# Altium schematic sheet power.SchDoc
size Letter
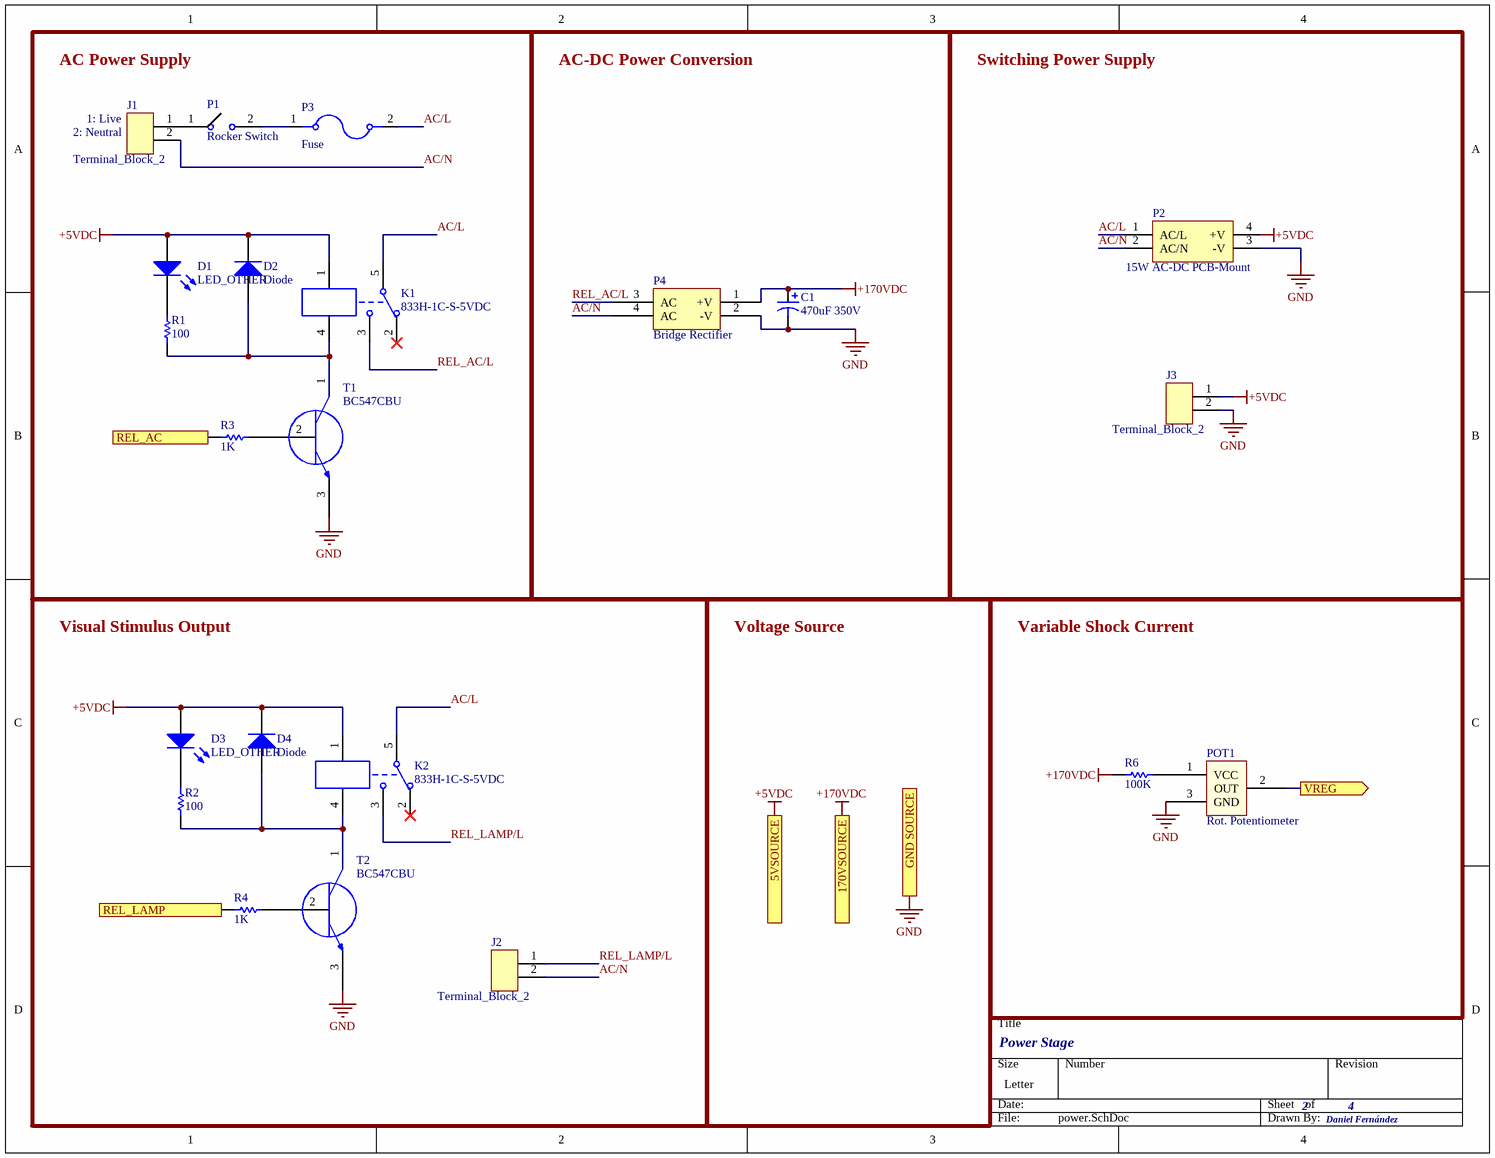
[diagram p0: power.SchDoc]

## Parts
C1  470uF 350V  [ESMQ351VSN471MR35S]
D1  LED_OTHER  [LED_AXIAL]
D2  Diode  [Diodo 1N4007 Rectificador]
D3  LED_OTHER  [LED_AXIAL]
D4  Diode  [Diodo 1N4007 Rectificador]
J1  Terminal_Block_2  [Terminal_Block_2]
J2  Terminal_Block_2  [Terminal_Block_2]
J3  Terminal_Block_2  [Terminal_Block_2]
K1  833H-1C-S-5VDC  [Relay_833H]
K2  833H-1C-S-5VDC  [Relay_833H]
P1  Rocker Switch  [Rocker Switch]
P2  15W AC-DC PCB-Mount  [15W AC-DC PCB-Mount]
P3  Fuse  [Fuse Holder]
P4  Bridge Rectifier  [KBPC1010]
POT1  Rot. Potentiometer  [PTV09A-4020F-B504]
R1  100  [RESISTOR]
R2  100  [RESISTOR]
R3  1K  [RESISTOR]
R4  1K  [RESISTOR]
R6  100K  [RESISTOR]
T1  BC547CBU  [BC547CBU]
T2  BC547CBU  [BC547CBU]

## Blocks framed on the sheet
AC Power Supply: D1 D2 J1 K1 P1 P3 R1 R3 T1
AC-DC Power Conversion: C1 P4
Switching Power Supply: J3 P2
Visual Stimulus Output: D3 D4 J2 K2 R2 R4 T2
Variable Shock Current: POT1 R6

## Ports
5VSOURCE (out), 170VSOURCE (out), GND SOURCE (out), REL_AC (in), REL_LAMP (in), VREG (out)

## Nets
+5VDC: D1.1(A) D2.2(C) D3.1(A) D4.2(C) J3.1 K1.1 K2.1 P2.4(+V) ; port 5VSOURCE
+170VDC: C1.1 P4.1(+V) R6.1 ; port 170VSOURCE
GND: C1.2 J3.2 P2.3(-V) P4.2(-V) POT1.3(GND) T1.3(E) T2.3(E) ; port GND SOURCE
AC/L: K1.5 K2.5 P2.1(AC/L) P3.2
AC/N: J1.2 J2.2 P2.2(AC/N) P4.4(AC)
REL_AC: R3.1 ; port REL_AC
REL_AC/L: K1.3(NO) P4.3(AC)
REL_LAMP: R4.1 ; port REL_LAMP
REL_LAMP/L: J2.1 K2.3(NO)
VREG: POT1.2(OUT) ; port VREG
NetD1_2: D1.2(K) R1.2
NetD2_1: D2.1(A) K1.4 R1.1 T1.1(C)
NetD3_2: D3.2(K) R2.2
NetD4_1: D4.1(A) K2.4 R2.1 T2.1(C)
NetJ1_1: J1.1 P1.1
NetP1_2: P1.2 P3.1
NetPOT1_1: POT1.1(VCC) R6.2
NetR3_2: R3.2 T1.2(B)
NetR4_2: R4.2 T2.2(B)

Not connected (* = marked no-connect by the designer): K1 2(NC)*; K2 2(NC)*

## Notes on the sheet
- (near J1) 2: Neutral
- (near J1) 1: Live
- Voltage Source
- Power Stage
- 2
- Daniel Fernández
- 4
- Title
- Size:
- Date:
- Letter
- Number:
- Time:
- Revision:
- Sheet
- of
- File:

## Library data of the parts
C1 = Capacitor_AXIAL_Pol: Manufacturer: *; Manufacturer Code: *
D1 D3 = LED_OTHER: Typical RED GaAs LED; Published: 8-Jun-2000; LatestRevisionDate: 08-Jul-2005; LatestRevisionNote: Mech Layer 1 removed.; PackageReference: LED-1; Publisher: Altium Limited; PackageDescription: LED; 2 Leads
D2 D4 = Diode: Default Diode; Published: 8-Jun-2000; LatestRevisionDate: 17-Jul-2002; LatestRevisionNote: Re-released for DXP Platform.; PackageVersion: Sep-1996; PackageReference: SMC; Publisher: Altium Limited; PackageDescription: DO-214-AB/SMC; 2 C-Bend Leads; Body 7.9 x 5.9 mm, inc. leads (LxW); Code_JEDEC: DO-214-AB
K1 K2 = Relay_Song 5V: Relay Song Chuan 5V; Manufacturer: Song Chuan; Manufacturer Code: 833H-1C-S-5VDC; HelpURL: C:\Varios\PERCRO_DATASHEET\Relay_833H.pdf
P4 = KBPC1010: Single-Phase Silicon Bridge Rectifier Rectifier
POT1 = ROT_POT: Rotatory Potentiometer
R1-R4 R6 = Resistor_Axial: Published: 8-Jun-2000; LatestRevisionDate: 17-Jul-2002; LatestRevisionNote: Re-released for DXP Platform.; PackageReference: AXIAL-0.3; Publisher: Altium Limited; PackageDescription: Axial Device, Thru-Hole; 2 Leads; 0.3 in Pin Spacing